# Altium schematic sheet BMS.SchDoc
size A4; SheetNumber: 11; SheetTotal: 11
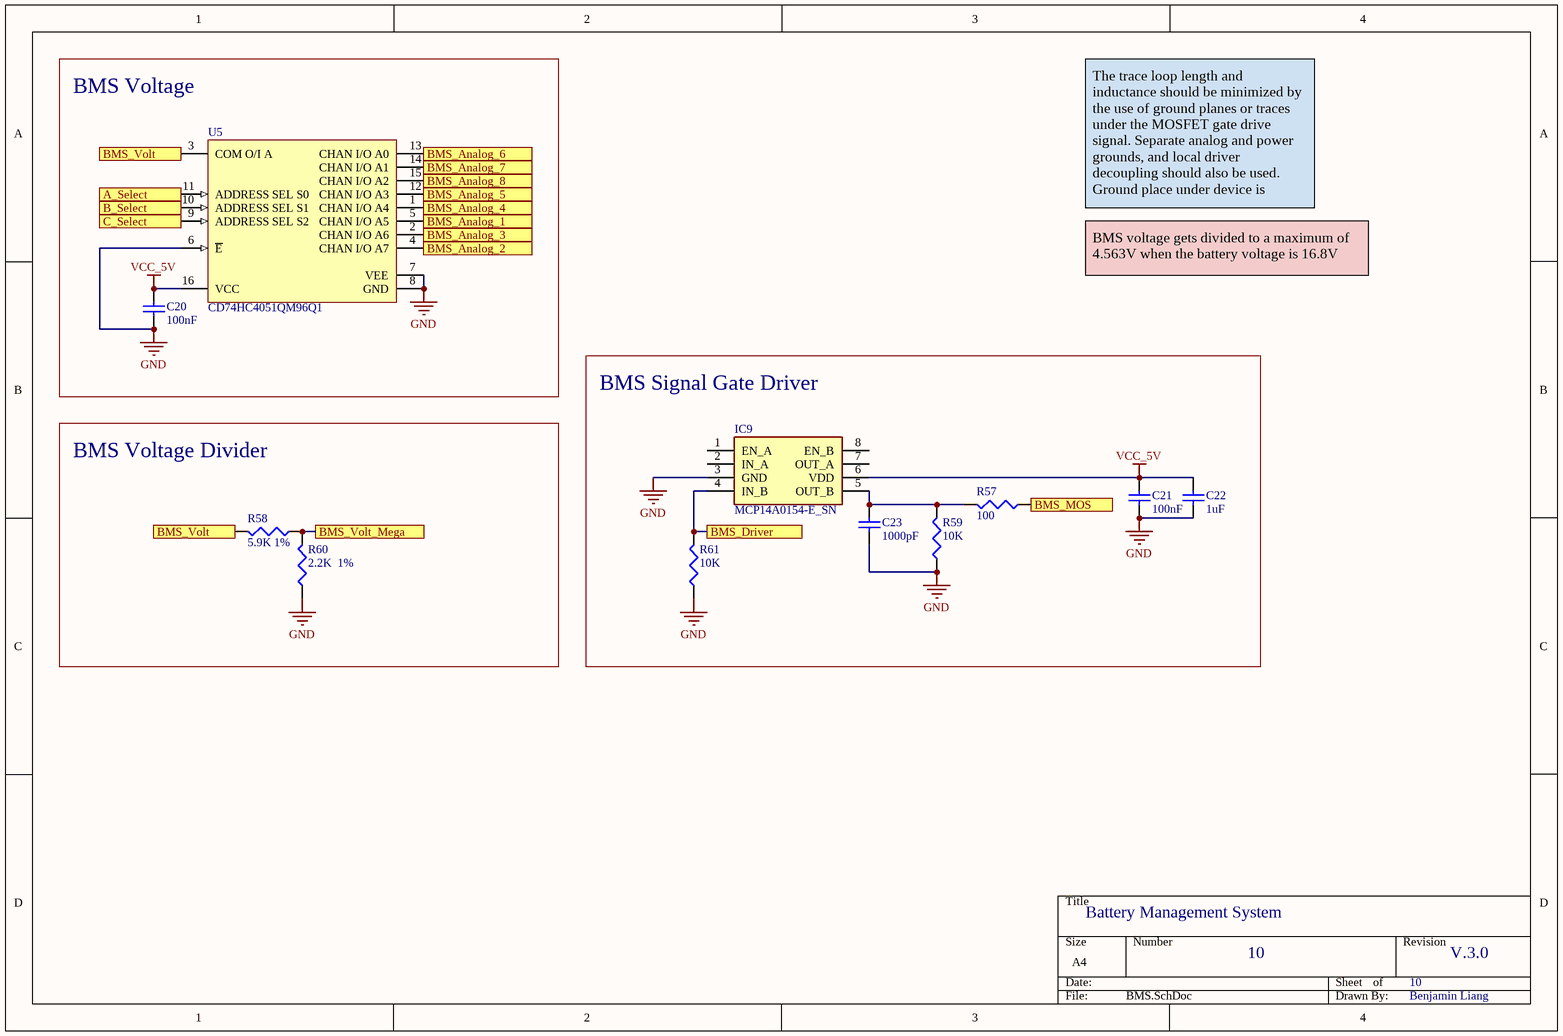
[diagram p0: BMS.SchDoc]

## Parts
C20  100nF  [C1206]
C21  100nF  [C1206]
C22  1uF  [C1206]
C23  1000pF  [C1206]
IC9  MCP14A0154-E_SN  [SOIC127P599X173-8N]
R57  100  [J1-0603]
R58  5.9K 1%  [J1-0603]
R59  10K  [J1-0603]
R60  2.2K  1%  [J1-0603]
R61  10K  [J1-0603]
U5  CD74HC4051QM96Q1  [D0016A_L]

## Blocks framed on the sheet
BMS Voltage: C20 U5
BMS Signal Gate Driver: C21-C23 IC9 R57 R59 R61
BMS Voltage Divider: R58 R60

## Ports
A_Select, B_Select, BMS_Analog_1, BMS_Analog_2, BMS_Analog_3, BMS_Analog_4, BMS_Analog_5, BMS_Analog_6, BMS_Analog_7, BMS_Analog_8, BMS_Driver, BMS_MOS, BMS_Volt, BMS_Volt_Mega, C_Select

## Nets
GND: C20.2 C21.2 C22.2 C23.2 IC9.3(GND) R59.1 R60.1 R61.1 U5.6(~{E}) U5.7(VEE) U5.8(GND)
VCC_5V: C20.1 C21.1 C22.1 IC9.6(VDD) U5.16(VCC)
A_Select: U5.11(ADDRESS_SEL_S0) ; port A_Select
B_Select: U5.10(ADDRESS_SEL_S1) ; port B_Select
BMS_Analog_1: U5.5(CHAN_I/O_A5) ; port BMS_Analog_1
BMS_Analog_2: U5.4(CHAN_I/O_A7) ; port BMS_Analog_2
BMS_Analog_3: U5.2(CHAN_I/O_A6) ; port BMS_Analog_3
BMS_Analog_4: U5.1(CHAN_I/O_A4) ; port BMS_Analog_4
BMS_Analog_5: U5.12(CHAN_I/O_A3) ; port BMS_Analog_5
BMS_Analog_6: U5.13(CHAN_I/O_A0) ; port BMS_Analog_6
BMS_Analog_7: U5.14(CHAN_I/O_A1) ; port BMS_Analog_7
BMS_Analog_8: U5.15(CHAN_I/O_A2) ; port BMS_Analog_8
BMS_Driver: IC9.4(IN_B) R61.2 ; port BMS_Driver
BMS_MOS: R57.1 ; port BMS_MOS
BMS_Volt: R58.2 U5.3(COM_O/I_A) ; port BMS_Volt
BMS_Volt_Mega: R58.1 R60.2 ; port BMS_Volt_Mega
C_Select: U5.9(ADDRESS_SEL_S2) ; port C_Select
NetC23_1: C23.1 IC9.5(OUT_B) R57.2 R59.2

Not connected (* = marked no-connect by the designer): IC9 1(EN_A) 2(IN_A) 7(OUT_A) 8(EN_B)

## Notes on the sheet
- The trace loop length and inductance should be minimized by
  the use of ground planes or traces under the MOSFET gate drive signal. Separate analog and power grounds, and local driver decoupling should also be used. Ground place under device is recommended.
- BMS voltage gets divided to a maximum of 4.563V when the battery voltage is 16.8V
- Battery Management System
- 10
- V.3.0
- Benjamin Liang

## Library data of the parts
C20 C21 = Cap Semi: Capacitor (Semiconductor SIM Model); Published: 8-Jun-2000; LatestRevisionDate: 29-May-2009; LatestRevisionNote: IPC-7351 Footprint Added.; PackageReference: C1206; Publisher: Altium Limited; PackageDescription: Chip Capacitor; Value: 100nF
C22 C23 = Cap Semi: Capacitor (Semiconductor SIM Model); Value: 100nF; Published: 8-Jun-2000; LatestRevisionDate: 29-May-2009; LatestRevisionNote: IPC-7351 Footprint Added.; PackageReference: C1206; Publisher: Altium Limited; PackageDescription: Chip Capacitor
IC9 = MCP14A0154-E_SN: Integrated Circuit; Manufacturer_Name: Microchip; Manufacturer_Part_Number: MCP14A0154-E/SN; Datasheet Link: http://www.microchip.com/mymicrochip/filehandler.aspx?ddocname=en584525; Height: 1.1mm; Mouser Part Number: 579-MCP14A0154-E/SN; Mouser Price/Stock: https://www.mouser.co.uk/ProductDetail/Microchip-Technology/MCP14A0154-E-SN?qs=BA62vJVifGqWAZTNBysjlw%3D%3D; Arrow Part Number: MCP14A0154-E/SN; Arrow Price/Stock: https://www.arrow.com/en/products/mcp14a0154-esn/microchip-technology?region=nac
R57 R59 = Res3: Resistor; Value: 47K; Published: 8-Jun-2000; LatestRevisionDate: 29-May-2009; LatestRevisionNote: IPC-7351 Footprint Added.; PackageReference: J1-0603; Publisher: Altium Limited; PackageDescription: Chip Resistor
R58 R60 = Res3: Resistor; Value: 220; Published: 8-Jun-2000; LatestRevisionDate: 29-May-2009; LatestRevisionNote: IPC-7351 Footprint Added.; PackageReference: J1-0603; Publisher: Altium Limited; PackageDescription: Chip Resistor
R61 = Res3: Resistor; Value: 4.7K; Published: 8-Jun-2000; LatestRevisionDate: 29-May-2009; LatestRevisionNote: IPC-7351 Footprint Added.; PackageReference: J1-0603; Publisher: Altium Limited; PackageDescription: Chip Resistor
U5 = CMP-1575-00013-4: Automotive Catalog High Speed CMOS Logic Analog Multiplexers/Demultiplexers, D0016A, LARGE T&R; Generic Part Number: CD74HC4051-Q1; Manufacturer: Texas Instruments; Configuration: 1 X 1：8 MUX; Bandwidth(Max)(MHz): 180; Crosstalk: Yes; VCC(Max)(V): 6; Ron(Max)(Ohms): 130; VCC(Min)(V): 2; Ron(Typ)(Ohms): 45; PackageReference: D0016A; Output Type: CMOS; Code_JEDEC: MS-012 variation AC; Operating Temperature Range(C): -40 to 125; DatasheetVersion: SCLS552A; PackageVersion: http://www.ti.com/lit/ml/mpds178g/mpds178g.pdf; Rating: Automotive